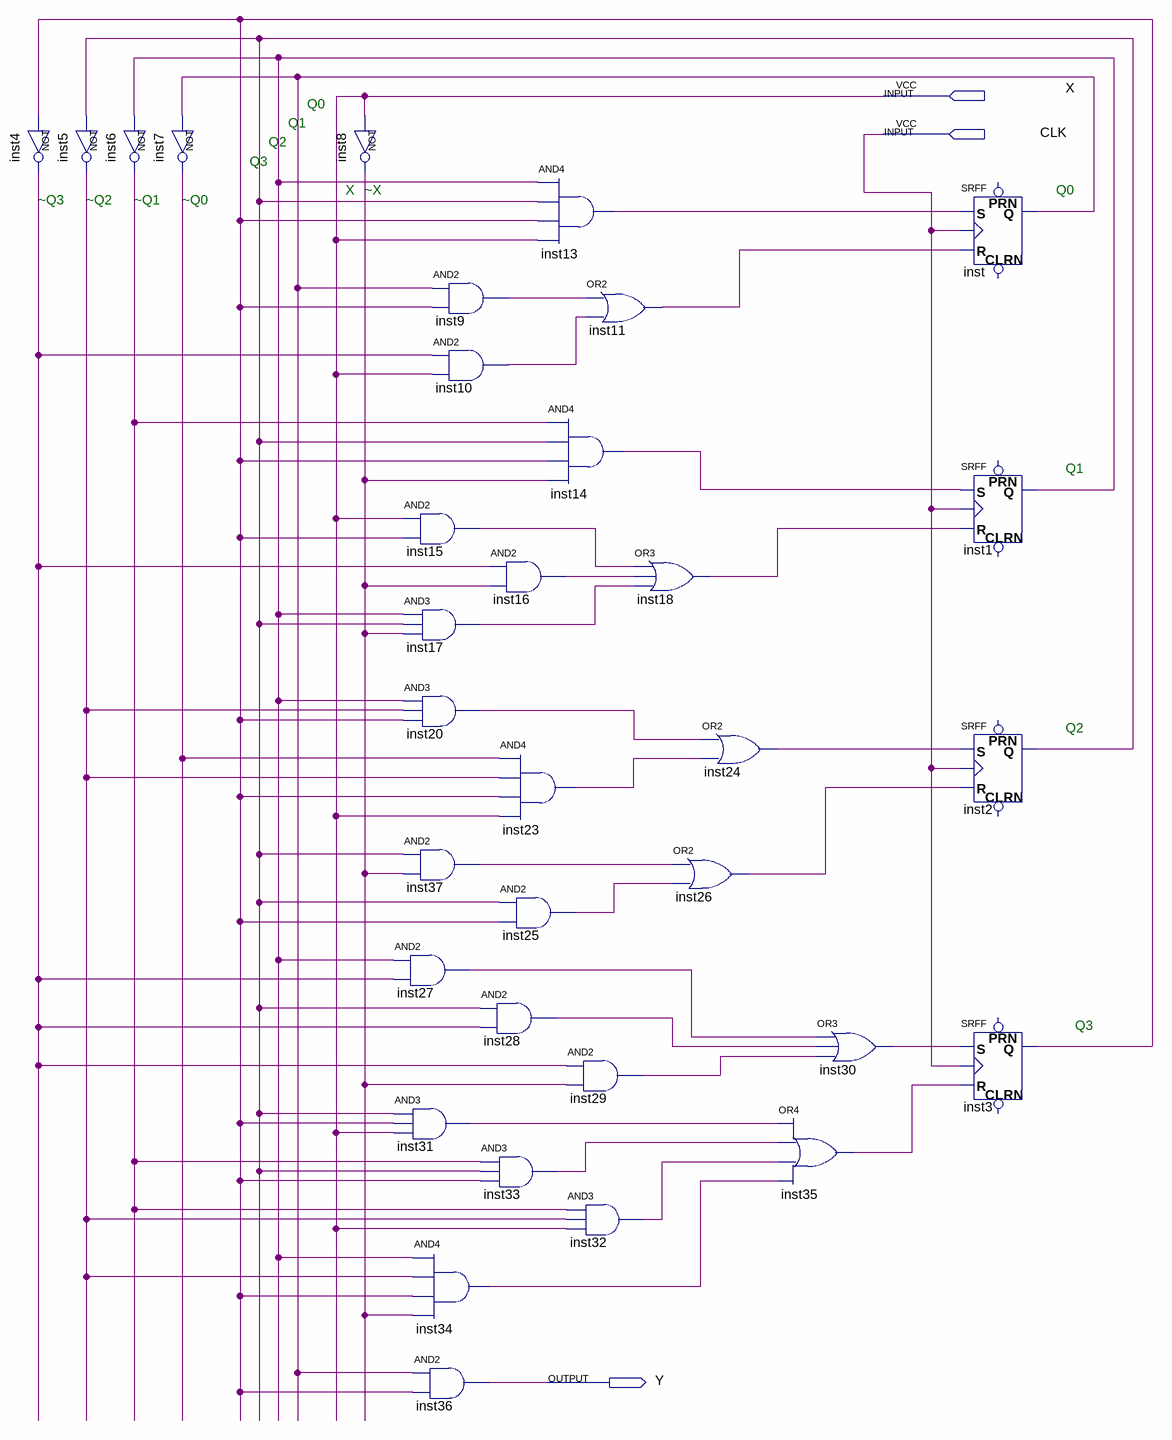
[diagram p0: schematic sheet]
// Quartus schematic Scheme.bdf as structural Verilog: 34 symbols, 3 pins
module Scheme (
  input  X,
  input  CLK,
  output Y
);

  wire inst1_q, inst2_q, inst3_q, inst4_out, inst5_out, inst6_out, inst7_out, inst8_out, inst9_out,
       inst10_out, inst11_out, inst13_out, inst14_out, inst15_out, inst16_out, inst17_out, inst18_out,
       inst20_out, inst23_out, inst24_out, inst25_out, inst26_out, inst27_out, inst28_out, inst29_out,
       inst30_out, inst31_out, inst32_out, inst33_out, inst34_out, inst35_out, inst37_out, inst_q;

  not inst4 (inst4_out, inst3_q);
  not inst5 (inst5_out, inst2_q);
  not inst6 (inst6_out, inst1_q);
  not inst7 (inst7_out, inst_q);
  not inst8 (inst8_out, X);
  and inst9 (inst9_out, inst_q, inst3_q);
  and inst10 (inst10_out, inst4_out, X);
  and inst15 (inst15_out, X, inst3_q);
  and inst17 (inst17_out, inst1_q, inst2_q, inst8_out);
  and inst20 (inst20_out, inst1_q, inst5_out, inst3_q);
  and inst37 (inst37_out, inst2_q, inst8_out);
  and inst27 (inst27_out, inst1_q, inst4_out);
  and inst31 (inst31_out, inst2_q, inst3_q, X);
  and inst34 (inst34_out, inst1_q, inst5_out, inst3_q, inst8_out);
  and inst36 (Y, inst_q, inst3_q);
  and inst16 (inst16_out, inst4_out, inst8_out);
  and inst23 (inst23_out, inst7_out, inst5_out, inst3_q, X);
  and inst25 (inst25_out, inst2_q, inst3_q);
  and inst28 (inst28_out, inst2_q, inst4_out);
  and inst33 (inst33_out, inst6_out, inst2_q, inst3_q);
  and inst13 (inst13_out, inst1_q, inst2_q, inst3_q, X);
  or inst11 (inst11_out, inst9_out, inst10_out);
  and inst14 (inst14_out, inst6_out, inst2_q, inst3_q, inst8_out);
  and inst29 (inst29_out, inst4_out, inst8_out);
  and inst32 (inst32_out, inst6_out, inst5_out, X);
  or inst18 (inst18_out, inst15_out, inst16_out, inst17_out);
  or inst26 (inst26_out, inst37_out, inst25_out);
  or inst24 (inst24_out, inst20_out, inst23_out);
  or inst30 (inst30_out, inst27_out, inst28_out, inst29_out);
  or inst35 (inst35_out, inst31_out, inst33_out, inst32_out, inst34_out);
  SRFF inst (.S(inst13_out), .R(inst11_out), .CLK(CLK), .Q(inst_q));  // open: PRN, CLRN
  SRFF inst1 (.S(inst14_out), .R(inst18_out), .CLK(CLK), .Q(inst1_q));  // open: PRN, CLRN
  SRFF inst2 (.S(inst24_out), .R(inst26_out), .CLK(CLK), .Q(inst2_q));  // open: PRN, CLRN
  SRFF inst3 (.S(inst30_out), .R(inst35_out), .CLK(CLK), .Q(inst3_q));  // open: PRN, CLRN

  // Notes on the sheet:
  //   Q0
  //   Q1
  //   Q2
  //   Q3
  //   X
  //   ~X
  //   Q0
  //   ~Q3
  //   ~Q2
  //   ~Q1
  //   ~Q0
  //   Q1
  //   Q2
  //   Q3
endmodule
